# Altium schematic sheet Audio_Video Router.SchDoc: Audio_Video Router
size A4; Organization: Altium Limited; Address1: L3, 12a Rodborough Rd; Address2: Frenchs Forest; Address3: NSW; Address4: Australia 2086; Revision: 1; SheetNumber: 1; SheetTotal: 11; Alumno: Diego Caceres; Curso: R1051; Materia: Sistemas de Representación; Docentes: Ing. Perdomo, Ing. Fuoco, Ing. Giorno, Sr. Vergili
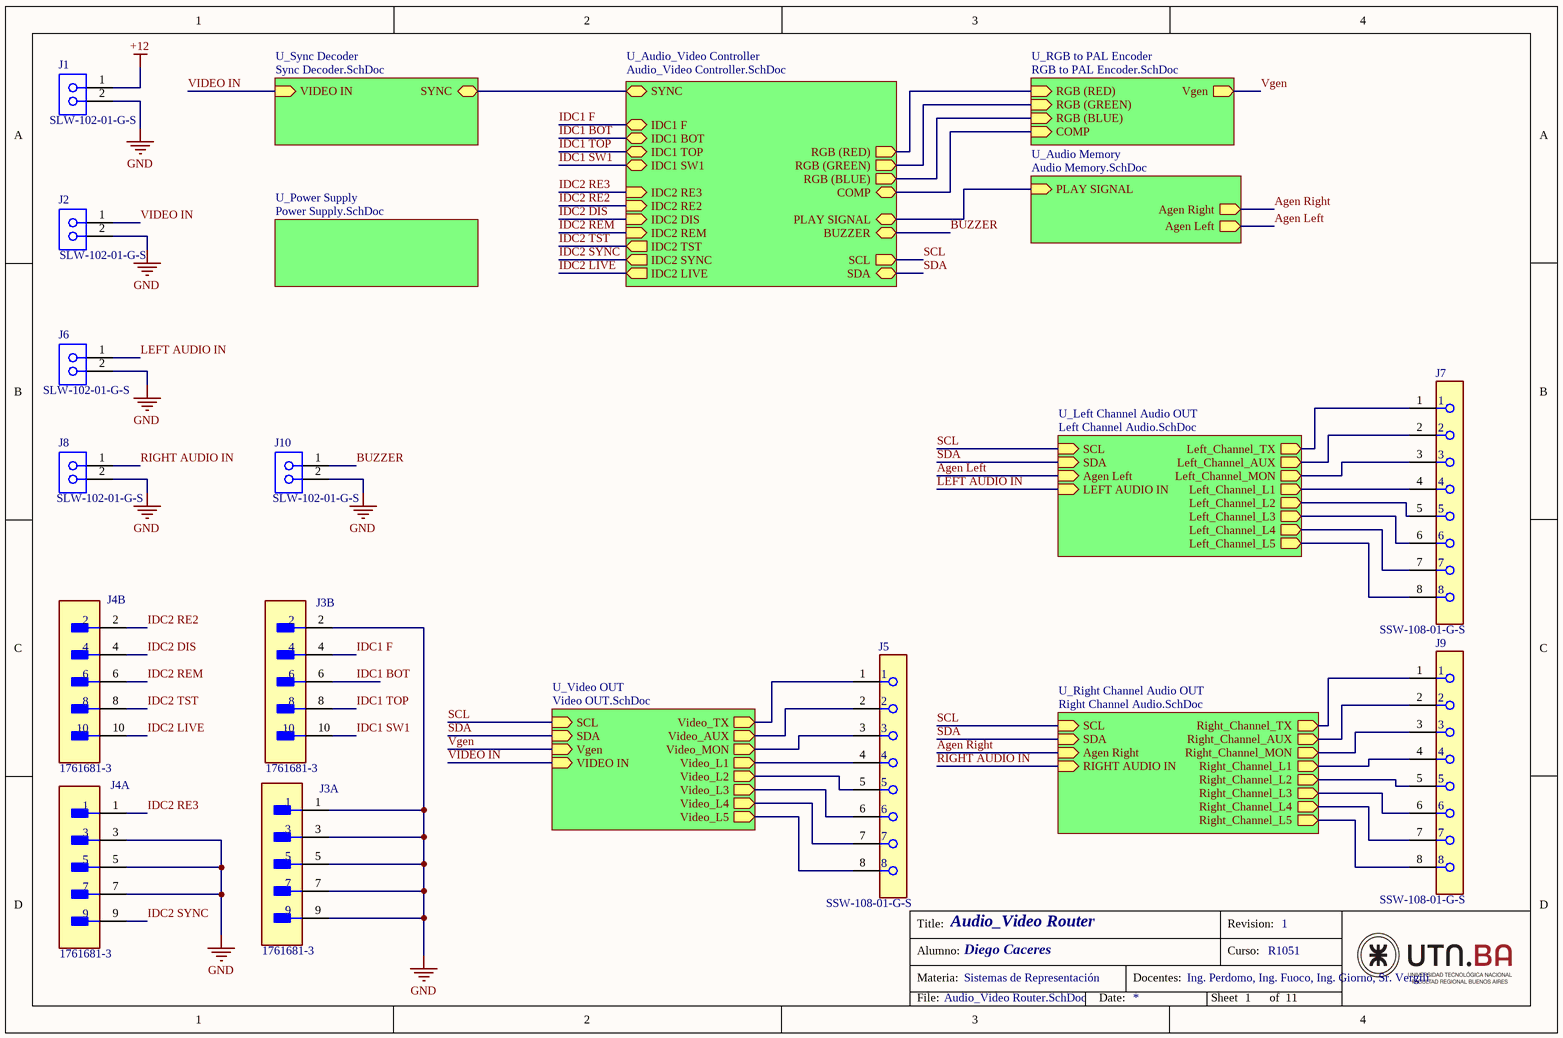
[diagram p0: Audio_Video Router.SchDoc]

## Parts
J1  SLW-102-01-G-S  [SMTC-SLW-102-01-X-S]
J2  SLW-102-01-G-S  [SMTC-SLW-102-01-X-S]
J3  1761681-3  [FP-1761681-3-MFG]  (parts A,B of 2)
J4  1761681-3  [FP-1761681-3-MFG]  (parts A,B of 2)
J5  SSW-108-01-G-S  [FP-SSW-108-01-G-S-MFG]
J6  SLW-102-01-G-S  [SMTC-SLW-102-01-X-S]
J7  SSW-108-01-G-S  [FP-SSW-108-01-G-S-MFG]
J8  SLW-102-01-G-S  [SMTC-SLW-102-01-X-S]
J9  SSW-108-01-G-S  [FP-SSW-108-01-G-S-MFG]
J10  SLW-102-01-G-S  [SMTC-SLW-102-01-X-S]

## Sub-sheets
U_Audio Memory = Audio Memory.SchDoc: PLAY SIGNAL (in), Agen Right (out), Agen Left (out)
U_Audio_Video Controller = Audio_Video Controller.SchDoc: RGB (RED) (out), RGB (GREEN) (out), RGB (BLUE) (out), COMP (bidir), SYNC (bidir), IDC2 SYNC (out), IDC2 LIVE (out), IDC2 TST (out), IDC2 REM (in), IDC2 DIS (in), IDC2 RE2 (in), IDC2 RE3 (in), IDC1 F (bidir), IDC1 BOT (bidir), IDC1 TOP (bidir), IDC1 SW1 (bidir), SCL (out), SDA (bidir), PLAY SIGNAL (bidir), BUZZER (bidir)
U_Left Channel Audio OUT = Left Channel Audio.SchDoc: Left_Channel_TX (out), Left_Channel_AUX (out), Left_Channel_MON (out), Left_Channel_L1 (out), SCL (in), SDA (in), Left_Channel_L2 (out), Left_Channel_L3 (out), Left_Channel_L4 (out), Left_Channel_L5 (out), Agen Left (in), LEFT AUDIO IN (in)
U_Power Supply = Power Supply.SchDoc: no entries
U_RGB to PAL Encoder = RGB to PAL Encoder.SchDoc: COMP (in), RGB (RED) (in), RGB (GREEN) (in), RGB (BLUE) (in), Vgen (out)
U_Right Channel Audio OUT = Right Channel Audio.SchDoc: Right_Channel_TX (out), Right_Channel_AUX (out), Right_Channel_MON (out), Right_Channel_L1 (out), SCL (in), SDA (in), Right_Channel_L2 (out), Right_Channel_L3 (out), Right_Channel_L4 (out), Right_Channel_L5 (out), Agen Right (in), RIGHT AUDIO IN (in)
U_Sync Decoder = Sync Decoder.SchDoc: VIDEO IN (in), SYNC (bidir)
U_Video OUT = Video OUT.SchDoc: Video_TX (out), Video_AUX (out), Video_MON (out), Video_L1 (out), SCL (in), SDA (in), Video_L2 (out), Video_L3 (out), Video_L4 (out), Video_L5 (out), Vgen (in), VIDEO IN (in)

## Nets
+12: J1.1
GND: J1.2 J2.2 J3.1 J3.2 J3.3 J3.5 J3.7 J3.9 J4.3 J4.5 J4.7 J6.2 J8.2 J10.2
Agen Left: sheet U_Audio Memory/Agen Left, sheet U_Left Channel Audio OUT/Agen Left
Agen Right: sheet U_Audio Memory/Agen Right, sheet U_Right Channel Audio OUT/Agen Right
BUZZER: J10.1 ; sheet U_Audio_Video Controller/BUZZER
IDC1 BOT: J3.6 ; sheet U_Audio_Video Controller/IDC1 BOT
IDC1 F: J3.4 ; sheet U_Audio_Video Controller/IDC1 F
IDC1 SW1: J3.10 ; sheet U_Audio_Video Controller/IDC1 SW1
IDC1 TOP: J3.8 ; sheet U_Audio_Video Controller/IDC1 TOP
IDC2 DIS: J4.4 ; sheet U_Audio_Video Controller/IDC2 DIS
IDC2 LIVE: J4.10 ; sheet U_Audio_Video Controller/IDC2 LIVE
IDC2 RE2: J4.2 ; sheet U_Audio_Video Controller/IDC2 RE2
IDC2 RE3: J4.1 ; sheet U_Audio_Video Controller/IDC2 RE3
IDC2 REM: J4.6 ; sheet U_Audio_Video Controller/IDC2 REM
IDC2 SYNC: J4.9 ; sheet U_Audio_Video Controller/IDC2 SYNC
IDC2 TST: J4.8 ; sheet U_Audio_Video Controller/IDC2 TST
LEFT AUDIO IN: J6.1 ; sheet U_Left Channel Audio OUT/LEFT AUDIO IN
RIGHT AUDIO IN: J8.1 ; sheet U_Right Channel Audio OUT/RIGHT AUDIO IN
SCL: sheet U_Audio_Video Controller/SCL, sheet U_Video OUT/SCL, sheet U_Left Channel Audio OUT/SCL, sheet U_Right Channel Audio OUT/SCL
SDA: sheet U_Audio_Video Controller/SDA, sheet U_Video OUT/SDA, sheet U_Left Channel Audio OUT/SDA, sheet U_Right Channel Audio OUT/SDA
Vgen: sheet U_RGB to PAL Encoder/Vgen, sheet U_Video OUT/Vgen
VIDEO IN: J2.1 ; sheet U_Sync Decoder/VIDEO IN, sheet U_Video OUT/VIDEO IN
NetJ5_1: J5.1 ; sheet U_Video OUT/Video_TX
NetJ5_2: J5.2 ; sheet U_Video OUT/Video_AUX
NetJ5_3: J5.3 ; sheet U_Video OUT/Video_MON
NetJ5_4: J5.4 ; sheet U_Video OUT/Video_L1
NetJ5_5: J5.5 ; sheet U_Video OUT/Video_L2
NetJ5_6: J5.6 ; sheet U_Video OUT/Video_L3
NetJ5_7: J5.7 ; sheet U_Video OUT/Video_L4
NetJ5_8: J5.8 ; sheet U_Video OUT/Video_L5
NetJ7_1: J7.1 ; sheet U_Left Channel Audio OUT/Left_Channel_TX
NetJ7_2: J7.2 ; sheet U_Left Channel Audio OUT/Left_Channel_AUX
NetJ7_3: J7.3 ; sheet U_Left Channel Audio OUT/Left_Channel_MON
NetJ7_4: J7.4 ; sheet U_Left Channel Audio OUT/Left_Channel_L1
NetJ7_5: J7.5 ; sheet U_Left Channel Audio OUT/Left_Channel_L2
NetJ7_6: J7.6 ; sheet U_Left Channel Audio OUT/Left_Channel_L3
NetJ7_7: J7.7 ; sheet U_Left Channel Audio OUT/Left_Channel_L4
NetJ7_8: J7.8 ; sheet U_Left Channel Audio OUT/Left_Channel_L5
NetJ9_1: J9.1 ; sheet U_Right Channel Audio OUT/Right_Channel_TX
NetJ9_2: J9.2 ; sheet U_Right Channel Audio OUT/Right_Channel_AUX
NetJ9_3: J9.3 ; sheet U_Right Channel Audio OUT/Right_Channel_MON
NetJ9_4: J9.4 ; sheet U_Right Channel Audio OUT/Right_Channel_L1
NetJ9_5: J9.5 ; sheet U_Right Channel Audio OUT/Right_Channel_L2
NetJ9_6: J9.6 ; sheet U_Right Channel Audio OUT/Right_Channel_L3
NetJ9_7: J9.7 ; sheet U_Right Channel Audio OUT/Right_Channel_L4
NetJ9_8: J9.8 ; sheet U_Right Channel Audio OUT/Right_Channel_L5
(unnamed): sheet U_Sync Decoder/SYNC, sheet U_Audio_Video Controller/SYNC
(unnamed): sheet U_Audio_Video Controller/RGB (RED), sheet U_RGB to PAL Encoder/RGB (RED)
(unnamed): sheet U_Audio_Video Controller/RGB (GREEN), sheet U_RGB to PAL Encoder/RGB (GREEN)
(unnamed): sheet U_Audio_Video Controller/RGB (BLUE), sheet U_RGB to PAL Encoder/RGB (BLUE)
(unnamed): sheet U_Audio_Video Controller/COMP, sheet U_RGB to PAL Encoder/COMP
(unnamed): sheet U_Audio_Video Controller/PLAY SIGNAL, sheet U_Audio Memory/PLAY SIGNAL

## Notes on the sheet
- Title:
- Revision:
- Alumno:
- Materia:
- Docentes:
- Curso:
- File:
- Date:
- Sheet
- of

## Library data of the parts
J1 J2 J6 J8 J10 = CMP-1023-00125-1: Low Profile Socket Strips, Through-hole, Vertical, -55 to 125 degC, 2.54 mm Pitch, 2-Pin, Female, RoHS; Manufacturer: Samtec; Pitch: 2.54 mm; PartNumber: SLW-102-01-G-S; ComponentLink3Description: Package Specification; Mounting Technology: Through-hole; DatasheetVersion: F-214; PackageVersion: X, 9/1987; ComponentLink3URL: http://www.samtec.com/documents/webfiles/cpdf/SLW-1XX-01-X-X-MKT.pdf; Orientation: Vertical; RoHS: True; PackageReference: SLW-102-01-X-S; ComponentLink2URL: http://www.samtec.com/documents/webfiles/pdf/SLW.PDF; Temperature Range: -55 to 125 degC; ComponentLink1URL: http://www.samtec.com; ComponentLink1Description: Manufacturer URL; ComponentLink2Description: Datasheet; PackageDescription: Low Profile Socket Strip
J3 J4 = CMP-03790-46506244-1: 1761681-3 Conn Shrouded Header (4 Sides) HDR 10 POS 2.54mm Solder ST Top Entry Thru-Hole Tray; Manufacturer Lifecycle Status: ACTIVE; Number of Contacts: 10; Current Rating: 1A; Connector Type: Header, Pin, Plug; Circuit Application: Signal; Voltage Rating: 250V; Insulation Resistance: 5GΩ; Lead Length: 2.9mm; PCB Mount Retention: Without; PCB Mounting Orientation: Vertical; Connector System: Wire-to-Board; Number of Rows: 2; Row Spacing: 2.54mm; Lead Pitch: 2.54mm; Contact Mating Length: 6.096mm; Depth: 9.22mm; Shrouded End Dimension: 3.81mm; Length: 20.32mm; Mount: Through Hole; Termination: Solder, Through Hole; Orientation: Vertical; Pitch: 2.54mm; Contact Gender: Male; Contact Material: Bronze; Contact Shape: Square; Height: 8.89mm; Housing Material: Polycyclohexylenedimethylene; Contact Current Rating: 1A; Operating Supply Voltage: 250V; Lifecycle Status: Production; Color: Black; NexarPartId: 46506244; Contact Plating: Gold, Tin; Packaging: Bulk; Flammability Rating: UL94 V-0; Max Operating Temperature: 105°C; Max Voltage Rating (AC): 250V; RoHS: Compliant; Mating Connector Lock: Without; Number of Positions: 10; Housing Color: Black; REACH SVHC: No SVHC; Radiation Hardening: No; Min Operating Temperature: -65°C
J5 J7 J9 = CMP-1272-00001-2: CONN RCPT 8POS 0.1 GOLD PCB; Pitch: 2.54mm; Number of Positions: 8; Max Current Rating: 6.9A; Gender: Receptacle; Max Voltage Rating (AC): 550V; Contact Resistance: 10mR; Mating Cycles: 100; Connector Type: Socket; Series: SSW; Length: 20.83mm; Packaging: Bulk; Contact Material: Bronze; Color: Black; Housing Material: Polymer; Number of Rows: 1; REACH SVHC: No SVHC; Lead Free: Lead Free; Termination: Solder; Max Operating Temperature: 125°C; Depth: 2.41mm; Number of Contacts: 8; Min Operating Temperature: -55°C; Housing Color: Black; RoHS Compliant: Yes; Contact Plating: Gold; Radiation Hardening: No; Contact Type: Female Socket; Orientation: Vertical; Voltage Rating: 550V; Current Rating: 6.9A